# Altium schematic sheet AddOffsets.SCHDOC
size B; Organization: Altium Limited; Address1: L3, 12a Rodborough Rd; Address2: Frenchs Forest; Address3: NSW; Address4: Australia 2086; DocumentNumber: 5; SheetNumber: 5; SheetTotal: 9
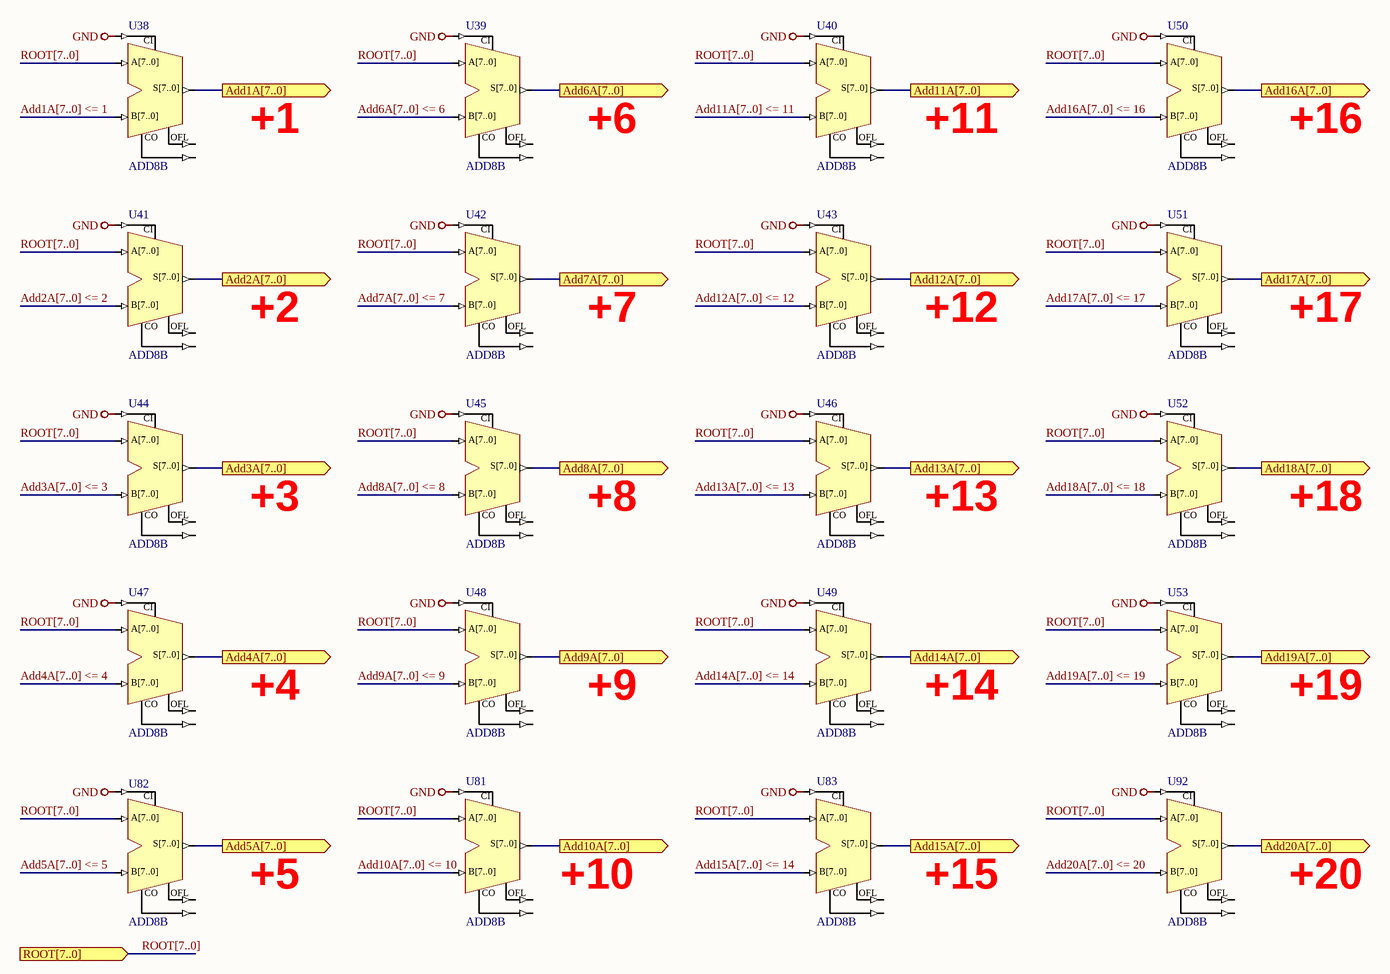
[diagram p0: AddOffsets.SCHDOC]

## Parts
U38  ADD8B
U39  ADD8B
U40  ADD8B
U41  ADD8B
U42  ADD8B
U43  ADD8B
U44  ADD8B
U45  ADD8B
U46  ADD8B
U47  ADD8B
U48  ADD8B
U49  ADD8B
U50  ADD8B
U51  ADD8B
U52  ADD8B
U53  ADD8B
U81  ADD8B
U82  ADD8B
U83  ADD8B
U92  ADD8B

## Ports
Add1A[7..0] (out), Add2A[7..0] (out), Add3A[7..0] (out), Add4A[7..0] (out), Add5A[7..0] (out), Add6A[7..0] (out), Add7A[7..0] (out), Add8A[7..0] (out), Add9A[7..0] (out), Add10A[7..0] (out), Add11A[7..0] (out), Add12A[7..0] (out), Add13A[7..0] (out), Add14A[7..0] (out), Add15A[7..0] (out), Add16A[7..0] (out), Add17A[7..0] (out), Add18A[7..0] (out), Add19A[7..0] (out), Add20A[7..0] (out), ROOT[7..0] (in)

## Nets
GND: U38.CI U39.CI U40.CI U41.CI U42.CI U43.CI U44.CI U45.CI U46.CI U47.CI U48.CI U49.CI U50.CI U51.CI U52.CI U53.CI U81.CI U82.CI U83.CI U92.CI
Add1A[7..0]: U38.S[7..0] ; port Add1A[7..0]
Add1A[7..0] <= 1: U38.B[7..0]
Add2A[7..0]: U41.S[7..0] ; port Add2A[7..0]
Add2A[7..0] <= 2: U41.B[7..0]
Add3A[7..0]: U44.S[7..0] ; port Add3A[7..0]
Add3A[7..0] <= 3: U44.B[7..0]
Add4A[7..0]: U47.S[7..0] ; port Add4A[7..0]
Add4A[7..0] <= 4: U47.B[7..0]
Add5A[7..0]: U82.S[7..0] ; port Add5A[7..0]
Add5A[7..0] <= 5: U82.B[7..0]
Add6A[7..0]: U39.S[7..0] ; port Add6A[7..0]
Add6A[7..0] <= 6: U39.B[7..0]
Add7A[7..0]: U42.S[7..0] ; port Add7A[7..0]
Add7A[7..0] <= 7: U42.B[7..0]
Add8A[7..0]: U45.S[7..0] ; port Add8A[7..0]
Add8A[7..0] <= 8: U45.B[7..0]
Add9A[7..0]: U48.S[7..0] ; port Add9A[7..0]
Add9A[7..0] <= 9: U48.B[7..0]
Add10A[7..0]: U81.S[7..0] ; port Add10A[7..0]
Add10A[7..0] <= 10: U81.B[7..0]
Add11A[7..0]: U40.S[7..0] ; port Add11A[7..0]
Add11A[7..0] <= 11: U40.B[7..0]
Add12A[7..0]: U43.S[7..0] ; port Add12A[7..0]
Add12A[7..0] <= 12: U43.B[7..0]
Add13A[7..0]: U46.S[7..0] ; port Add13A[7..0]
Add13A[7..0] <= 13: U46.B[7..0]
Add14A[7..0]: U49.S[7..0] ; port Add14A[7..0]
Add14A[7..0] <= 14: U49.B[7..0]
Add15A[7..0]: U83.S[7..0] ; port Add15A[7..0]
Add15A[7..0] <= 14: U83.B[7..0]
Add16A[7..0]: U50.S[7..0] ; port Add16A[7..0]
Add16A[7..0] <= 16: U50.B[7..0]
Add17A[7..0]: U51.S[7..0] ; port Add17A[7..0]
Add17A[7..0] <= 17: U51.B[7..0]
Add18A[7..0]: U52.S[7..0] ; port Add18A[7..0]
Add18A[7..0] <= 18: U52.B[7..0]
Add19A[7..0]: U53.S[7..0] ; port Add19A[7..0]
Add19A[7..0] <= 19: U53.B[7..0]
Add20A[7..0]: U92.S[7..0] ; port Add20A[7..0]
Add20A[7..0] <= 20: U92.B[7..0]
ROOT[7..0]: U38.A[7..0] U39.A[7..0] U40.A[7..0] U41.A[7..0] U42.A[7..0] U43.A[7..0] U44.A[7..0] U45.A[7..0] U46.A[7..0] U47.A[7..0] U48.A[7..0] U49.A[7..0] U50.A[7..0] U51.A[7..0] U52.A[7..0] U53.A[7..0] U81.A[7..0] U82.A[7..0] U83.A[7..0] U92.A[7..0] ; port ROOT[7..0]

Not connected (* = marked no-connect by the designer): U38 CO OFL; U39 CO OFL; U40 CO OFL; U41 CO OFL; U42 CO OFL; U43 CO OFL; U44 CO OFL; U45 CO OFL; U46 CO OFL; U47 CO OFL; U48 CO OFL; U49 CO OFL; U50 CO OFL; U51 CO OFL; U52 CO OFL; U53 CO OFL; U81 CO OFL; U82 CO OFL; U83 CO OFL; U92 CO OFL

## Buses and harness runs
bus Add1A[7..0] <= 1
bus Add2A[7..0] <= 2
bus Add3A[7..0] <= 3
bus Add4A[7..0] <= 4
bus Add5A[7..0] <= 5
bus Add6A[7..0] <= 6
bus Add7A[7..0] <= 7
bus Add8A[7..0] <= 8
bus Add9A[7..0] <= 9
bus Add10A[7..0] <= 10
bus Add11A[7..0] <= 11
bus Add12A[7..0] <= 12
bus Add13A[7..0] <= 13
bus Add14A[7..0] <= 14
bus Add15A[7..0] <= 14
bus Add16A[7..0] <= 16
bus Add17A[7..0] <= 17
bus Add18A[7..0] <= 18
bus Add19A[7..0] <= 19
bus Add20A[7..0] <= 20
bus ROOT[7..0]
bus ROOT[7..0] = port ROOT[7..0]

## Notes on the sheet
- +1
- +6
- +11
- +16
- +2
- +7
- +12
- +17
- +3
- +8
- +13
- +18
- +4
- +9
- +14
- +19
- +5
- (near U81) +10
- +15
- +20
- Title
- Size:
- Date:
- B
- Number:
- Time:
- Revision:
- Sheet
- of
- File:

## Library data of the parts
U38-U53 U81-U83 U92 = ADD8B: 8-Bit Cascadable Full Adder with Signed and Unsigned Operations, Bus Version; Xilinx Equivalent: ADD8; ArchiveName: GENERIC; Published: 18-Dec-2003; Publisher: Altium Limited; Core Revision: 1.00.00